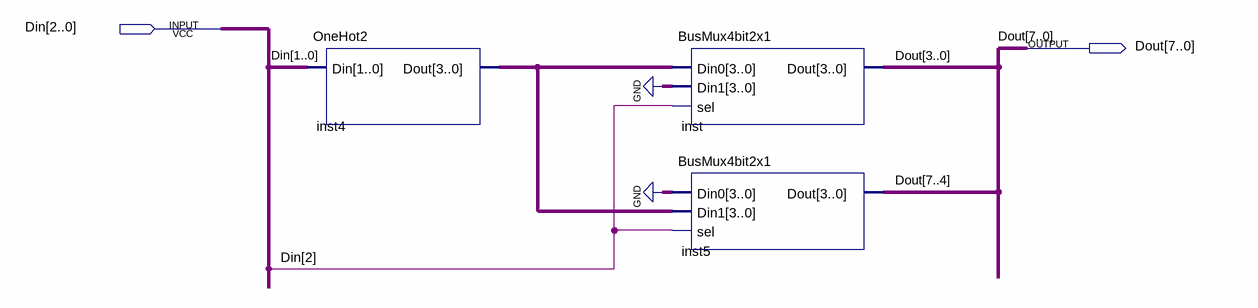
[diagram p0: schematic sheet]
// Quartus schematic OneHotEncoder3.bdf as structural Verilog: 3 symbols, 2 pins
module OneHotEncoder3 (
  input  [2:0] Din,
  output [7:0] Dout
);

  wire [3:0] inst4_dout;

  OneHot2 inst4 (.Din(Din[1:0]), .Dout(inst4_dout));
  BusMux4bit2x1 inst (.Din0(inst4_dout), .Din1(4'b0000), .sel(Din[2]), .Dout(Dout[3:0]));
  BusMux4bit2x1 inst5 (.Din0(4'b0000), .Din1(inst4_dout), .sel(Din[2]), .Dout(Dout[7:4]));
endmodule
